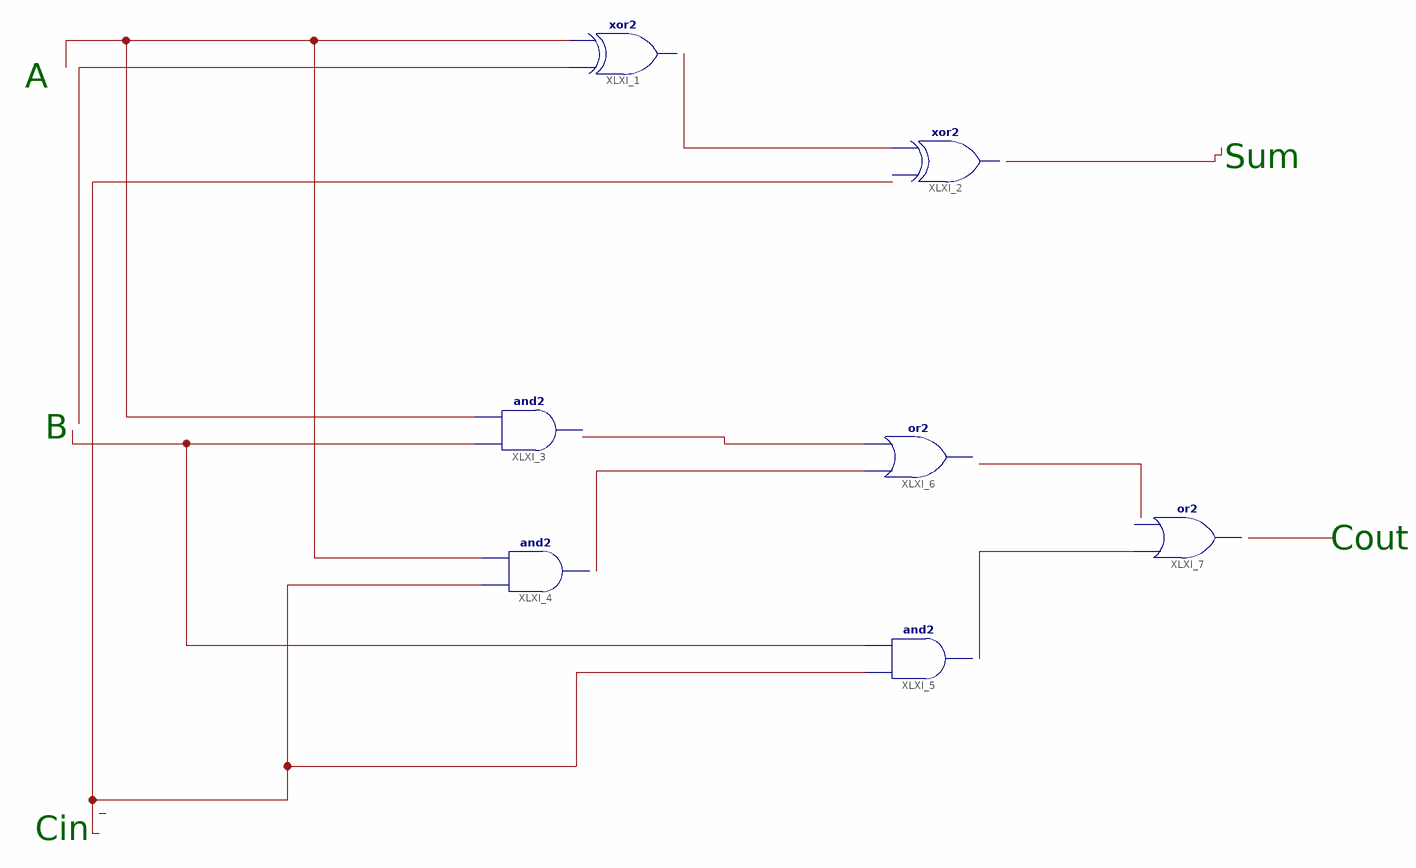
[diagram p0: schematic sheet 1]
// Xilinx ISE schematic Lab2_Add_Sub_Schematic.sch (spartan3e) as structural Verilog: 7 symbols, 0 ports
module Lab2_Add_Sub_Schematic (
);

  wire XLXN_2, XLXN_3, XLXN_4, XLXN_9, XLXN_10, XLXN_13, XLXN_14, XLXN_15;

  // xor2 XLXI_1 has open pins: I0=XLXN_2, I1=XLXN_9, O=open
  // xor2 XLXI_2 has open pins: I0=open, I1=XLXN_3, O=open
  // and2 XLXI_3 has open pins: I0=XLXN_13, I1=XLXN_9, O=open
  // and2 XLXI_4 has open pins: I0=XLXN_4, I1=XLXN_9, O=open
  // and2 XLXI_5 has open pins: I0=XLXN_4, I1=XLXN_13, O=open
  // or2 XLXI_6 has open pins: I0=XLXN_15, I1=XLXN_10, O=open
  // or2 XLXI_7 has open pins: I0=XLXN_14, I1=open, O=open

  // Notes on the sheet:
  //   A
  //   Sum
  //   B
  //   Cout
  //   Cin
endmodule
